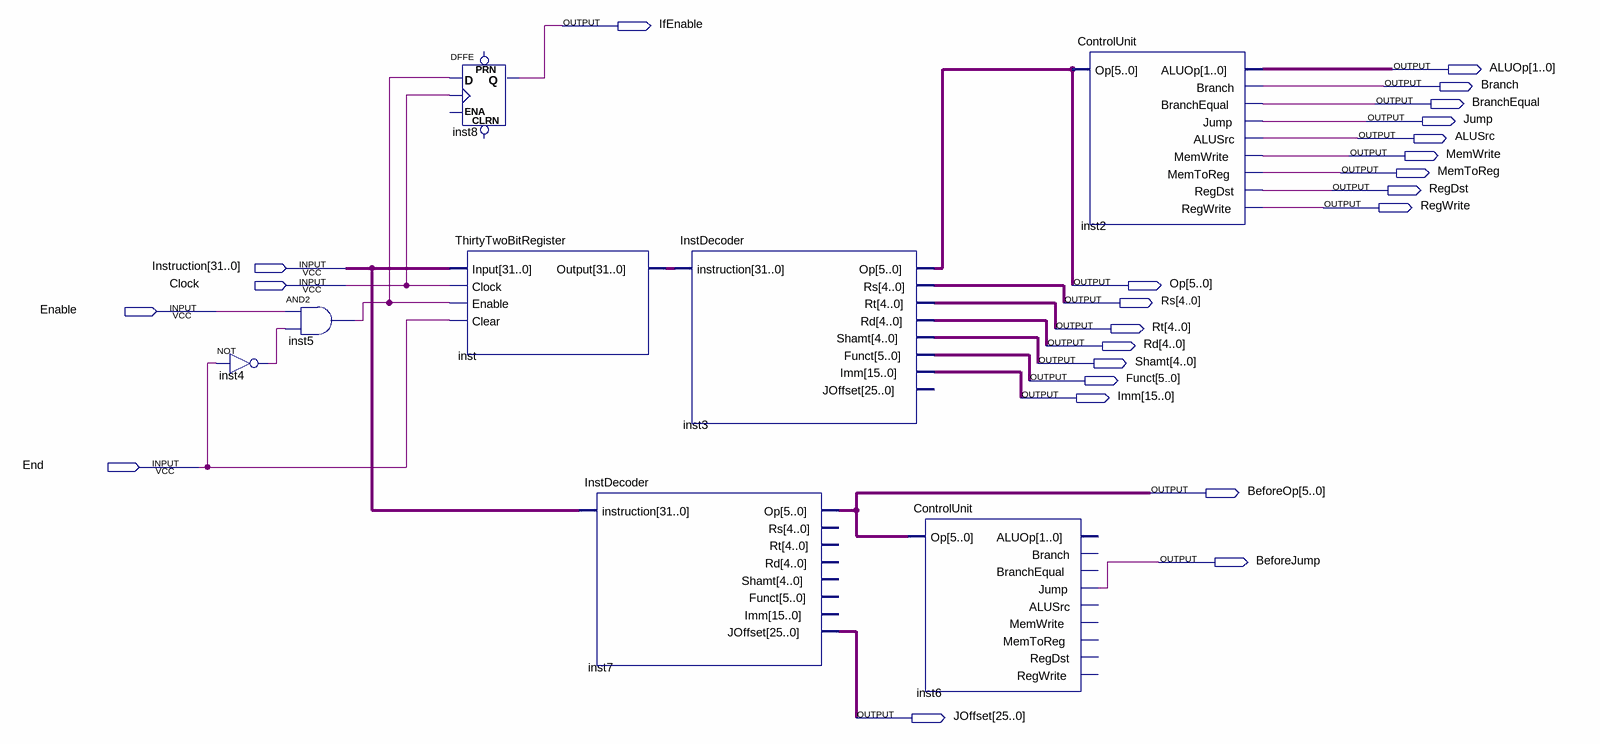
[diagram p0: schematic sheet]
// Quartus schematic IFStage.bdf as structural Verilog: 8 symbols, 24 pins
module IFStage (
  input  [31:0] Instruction,
  input  Clock,
  input  Enable,
  input  End,
  output IfEnable,
  output [1:0] ALUOp,
  output Branch,
  output BranchEqual,
  output Jump,
  output ALUSrc,
  output MemWrite,
  output MemToReg,
  output RegDst,
  output RegWrite,
  output [5:0] Op,
  output [4:0] Rs,
  output [4:0] Rt,
  output [4:0] Rd,
  output [4:0] Shamt,
  output [5:0] Funct,
  output [15:0] Imm,
  output [5:0] BeforeOp,
  output BeforeJump,
  output [25:0] JOffset
);

  wire inst4_out, inst5_out;
  wire [31:0] inst_output;

  not inst4 (inst4_out, End);
  and inst5 (inst5_out, Enable, inst4_out);
  DFFE inst8 (.D(inst5_out), .CLK(Clock), .Q(IfEnable));  // open: PRN, CLRN, ENA
  ThirtyTwoBitRegister inst (.Input(Instruction), .Clock(Clock), .Enable(inst5_out), .Clear(End), .Output(inst_output));
  InstDecoder inst7 (
    .instruction(Instruction), .Op(BeforeOp), .JOffset(JOffset));  // open: Rs, Rt, Rd, Shamt, Funct, Imm
  InstDecoder inst3 (
    .instruction(inst_output), .Op(Op), .Rs(Rs), .Rt(Rt), .Rd(Rd), .Shamt(Shamt), .Funct(Funct), .Imm(Imm));  // open: JOffset
  ControlUnit inst6 (
    .Op(BeforeOp), .Jump(BeforeJump));  // open: ALUOp, Branch, BranchEqual, ALUSrc, MemWrite, MemToReg, RegDst, RegWrite
  ControlUnit inst2 (
    .Op(Op), .ALUOp(ALUOp), .Branch(Branch), .BranchEqual(BranchEqual), .Jump(Jump), .ALUSrc(ALUSrc),
    .MemWrite(MemWrite), .MemToReg(MemToReg), .RegDst(RegDst), .RegWrite(RegWrite));
endmodule
